# EAGLE design pixel (EAGLE 8.6.0)
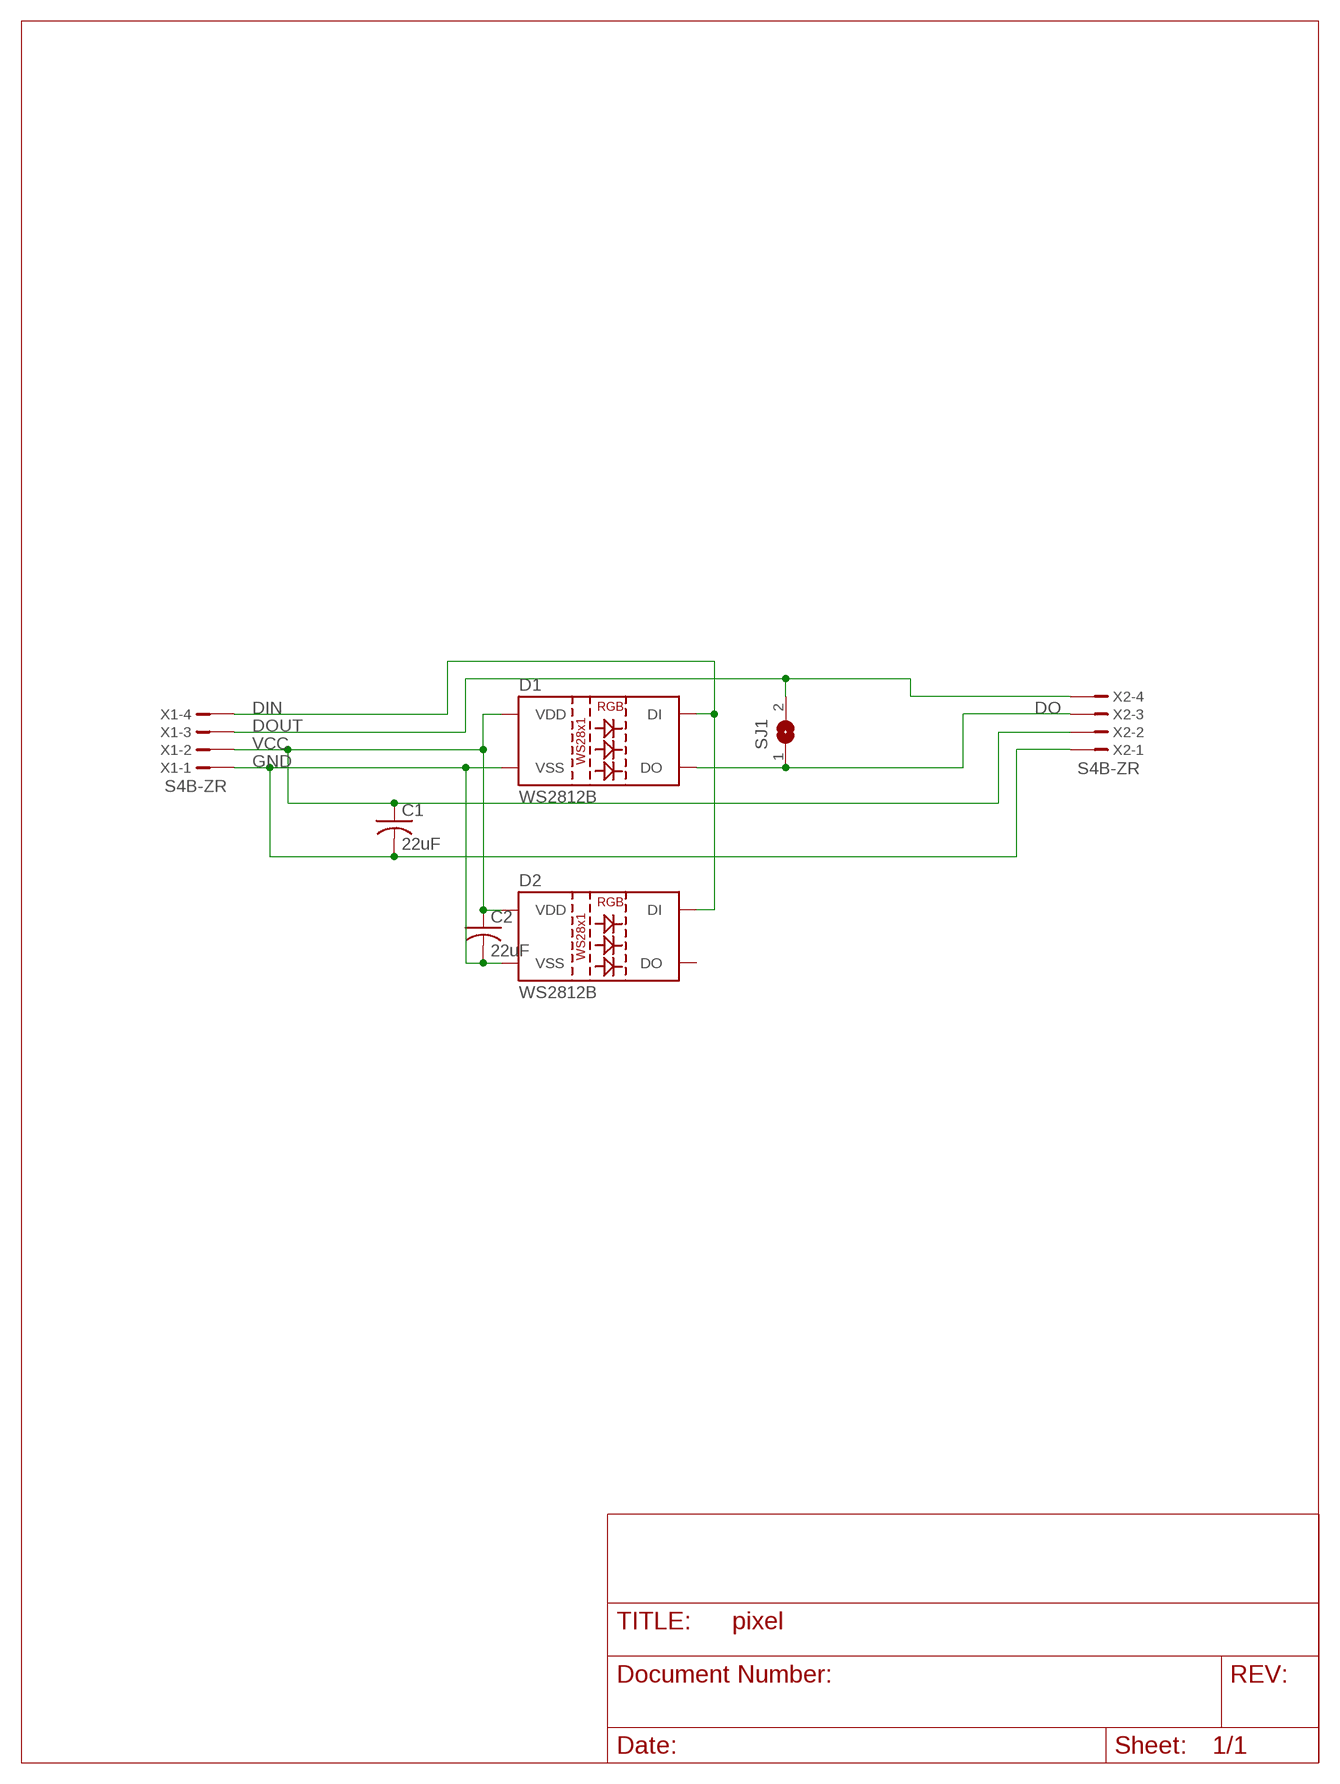
[diagram p0: schematic, sheet 1]

## Parts
C1  22uF  C-USC0402  [C0402]
C2  22uF  C-USC0402  [C0402]
D1  WS2812B  [WS2812B]
D2  WS2812B  [WS2812B]
SJ1  SJ  [SJ]
X1  S4B-ZR  [S4B-ZR]
X2  S4B-ZR  [S4B-ZR]

## Nets
DIN: D1.4(DI) D2.4(DI) X1.4
DO: D1.2(DO) SJ1.1 X2.3
DOUT: SJ1.2 X1.3 X2.4
GND: C1.2 C2.2 D1.3(VSS) D2.3(VSS) X1.1 X2.1
VCC: C1.1 C2.1 D1.1(VDD) D2.1(VDD) X1.2 X2.2
Unconnected: D2.2(DO)

## Library data of the parts
C1 C2 = adafruit:C-US: CAPACITOR, American symbol
D1 D2 = SparkFun-LED:WS2812B: WS2812B SMD addressable RGB LED 5x5mm SMD LED with built-in controller IC. Color: Red/Green/Blue mC Rating: RGB: 390, 660, 180 mcd Forward Voltage: RGB: 2.0, 3.0, 3.0 V Packages:WS2812B SparkFun Products: Blynk Board - ESP8266 <https://www.sparkfun.com/products/13794>; PROD_ID: DIO-12503
SJ1 = jumper:SJ: SMD solder JUMPER
X1 X2 = con-jst:?4B-ZR: ZH CONNECTOR 1.5 mm, 4 pin 1 row Source: http://www.jst.com .. eZH.pdf; MF: FARNELL; MPN: S4B-ZR(LF)(SN); OC_FARNELL: 9491830; OC_NEWARK: 38K8076

## Board
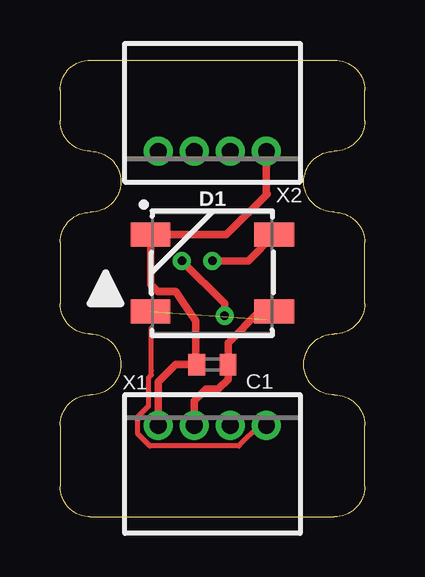
[diagram p1: board, top side]
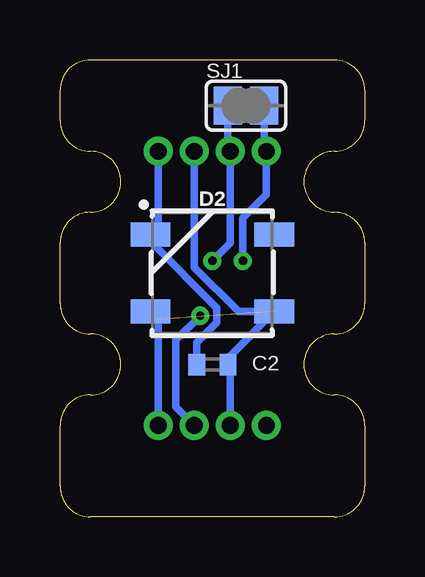
[diagram p2: board, bottom side, seen from below]

Size 12.7 x 19.05 mm. Coordinates in mm from the lower left corner, seen from the top.
Outline: 0,17.78 0,16.51 arc90 1.27,15.24 arc-90 2.54,13.97 arc-90 1.27,12.7 arc90 0,11.43 0,8.89 arc90 1.27,7.62 arc-90 2.54,6.35 arc-90 1.27,5.08 arc90 0,3.81 0,1.27 arc90 1.27,0 11.43,0 arc90 12.7,1.27 12.7,3.81 arc90 11.43,5.08 arc-90 10.16,6.35 arc-90 11.43,7.62 arc90 12.7,8.89 12.7,11.43 arc90 11.43,12.7 arc-90 10.16,13.97 arc-90 11.43,15.24 arc90 12.7,16.51 12.7,17.78 arc90 11.43,19.05 1.27,19.05 arc90 0,17.78
Copper layers (1*16): Top 0.035mm / dielectric 1.5mm / Bottom 0.035mm
Design rules "default": minimum track width 6mil, minimum drill 0.35mm, track to track 6mil, track to pad 6mil, pad to pad 6mil, via to via 6mil, smd to smd 6mil, copper to edge 40mil, drill to drill 6mil, minimum pad ring 10mil, minimum via ring 8mil, stop-mask expansion 4mil, vias tented up to drill 0mil, thermal gap 10mil

### Footprints (pad centres in the part's own frame; a part is rotated, then mirrored left to right if it is on the bottom)
C0402 = smd 0.7 x 0.9: 1 -0.65,0; 2 0.65,0
WS2812B = smd 1.651 x 1: 1 2.577,-1.6; 2 2.577,1.6; 3 -2.577,1.6; 4 -2.577,-1.6
SJ = smd 1.168 x 1.6: 1 -0.762,0; 2 0.762,0
S4B-ZR = drill 0.7 pad 1.1: 1 -2.25,0; 2 -0.75,0; 3 0.75,0; 4 2.25,0

### Placement (x,y rotation side)
C1  6.35,6.35 180 top
C2  6.35,6.35 180 bottom
D1  6.35,10.16 0 top
D2  6.35,10.16 0 bottom
SJ1  4.95,17.14 0 bottom
X1  6.35,3.81 0 top
X2  6.35,15.24 180 top

### Tracks (layer width: path | path; a pad name or v marks a point on that pad's centre or on a via)
DIN  (1 unrouted)
  Top 0.203: X1.4 8.31,3.81 7.46,2.95 3.75,2.95 3.24,3.46 3.24,4.17 3.69,4.62 3.69,5.79 3.81,5.91 3.81,6.1 3.81,7.87
  Bottom 0.305: X1.4 8.6,8.23 D2.4
DO  (via drill 0.35)
  Top 0.305: v6.35,10.67 7.83,10.67 D1.2
  Bottom 0.305: SJ1.1 5.71,15.36 X2.3 5.6,11.42 v6.35,10.67
DOUT  (via drill 0.35)
  Top 0.305: v5.08,10.67 6.86,8.89 v6.86,8.38
  Bottom 0.305: SJ1.2 4.19,15.33 X2.4 4.1,13.43 5.08,12.45 v5.08,10.67 | v6.86,8.38 7.87,7.37 7.87,4.58 X1.3
GND
  Top 0.305: X1.1 4.1,5.62 4.83,6.35 C1.2 | X2.1 8.6,13.5 8.64,13.46 6.93,11.76 D1.3 3.77,9.69 4.06,9.4 4.83,9.4 5.08,9.01 5.67,8.17 5.67,6.38 C1.2 | 5.59,6.49 C1.2
  Bottom 0.305: X2.1 8.6,12.09 D2.3 8.93,11.47 6.17,8.71 6.17,8.3 | 6.17,8.3 6.17,8.31 | C2.2 7,7.27 6.17,8.1 6.17,8.3
VCC
  Top 0.305: X1.2 5.6,4.84 6.1,5.33 6.6,5.33 7,5.73 C1.1 7,7.25 8.31,8.56 D1.1
  Bottom 0.305: X2.2 7.1,10.4 5.26,8.56 D2.1 | D2.1 3.77,8.28 | X1.2 5.6,6.25 C2.1 5.7,6.63 D2.1